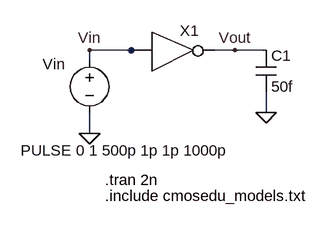
[diagram p0: schematic 4-NOT_symbol.asc]
4-NOT_symbol.asc, the LTspice schematic file:
Version 4
SHEET 1 1136 680
WIRE 496 -176 432 -176
WIRE 528 -176 496 -176
WIRE 656 -176 624 -176
WIRE 704 -176 656 -176
WIRE 432 -160 432 -176
WIRE 704 -80 704 -112
WIRE 432 -48 432 -80
FLAG 432 -48 0
FLAG 656 -176 Vout
FLAG 432 -176 Vin
FLAG 704 -80 0
SYMBOL voltage 432 -176 R0
WINDOW 0 -72 21 Left 2
WINDOW 3 -106 154 Left 2
WINDOW 123 0 0 Left 2
WINDOW 39 0 0 Left 2
SYMATTR InstName Vin
SYMATTR Value PULSE 0 1 500p 1p 1p 1000p
SYMBOL cap 688 -176 R0
SYMATTR InstName C1
SYMATTR Value 50f
SYMBOL NOT 528 -208 R0
SYMATTR InstName X1
TEXT 456 24 Left 2 !.tran 2n
TEXT 456 48 Left 2 !.include cmosedu_models.txt

The netlist it stands for:
* 4-NOT_symbol.asc
Vin Vin 0 PULSE 0 1 500p 1p 1p 1000p
C1 Vout 0 50f
XX1 Vin Vout NOT  ; pins In Out
.tran 2n
.include cmosedu_models.txt
.backanno
.end